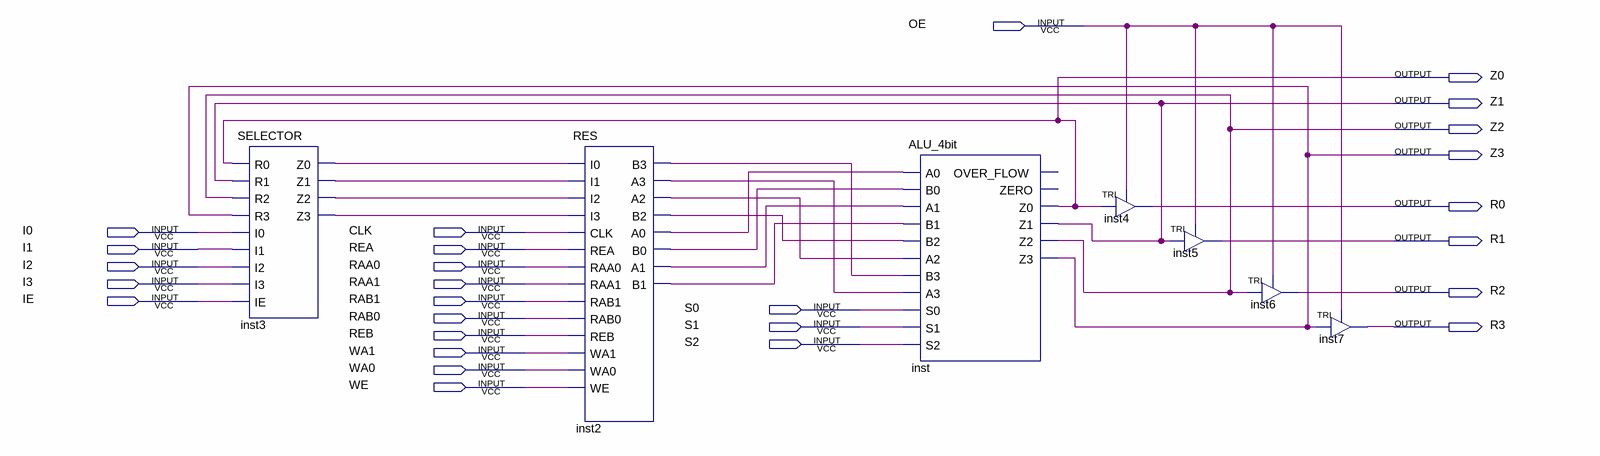
[diagram p0: schematic sheet]
// Quartus schematic DATAPATH.bdf as structural Verilog: 7 symbols, 27 pins
module DATAPATH (
  input  OE,
  input  I0,
  input  CLK,
  input  I1,
  input  REA,
  input  I2,
  input  RAA0,
  input  I3,
  input  RAA1,
  input  IE,
  input  RAB1,
  input  S0,
  input  RAB0,
  input  S1,
  input  REB,
  input  S2,
  input  WA1,
  input  WA0,
  input  WE,
  output Z0,
  output Z1,
  output Z2,
  output Z3,
  output R0,
  output R1,
  output R2,
  output R3
);

  wire inst2_a0, inst2_a1, inst2_a2, inst2_a3, inst2_b0, inst2_b1, inst2_b2, inst2_b3, inst3_z0, inst3_z1,
       inst3_z2, inst3_z3;

  SELECTOR inst3 (
    .R0(Z0), .R1(Z1), .R2(Z2), .R3(Z3), .I0(I0), .I1(I1), .I2(I2), .I3(I3), .IE(IE), .Z0(inst3_z0),
    .Z1(inst3_z1), .Z2(inst3_z2), .Z3(inst3_z3));
  RES inst2 (
    .I0(inst3_z0), .I1(inst3_z1), .I2(inst3_z2), .I3(inst3_z3), .CLK(CLK), .REA(REA), .RAA0(RAA0),
    .RAA1(RAA1), .RAB1(RAB1), .RAB0(RAB0), .REB(REB), .WA1(WA1), .WA0(WA0), .WE(WE), .B3(inst2_b3),
    .A3(inst2_a3), .A2(inst2_a2), .B2(inst2_b2), .A0(inst2_a0), .B0(inst2_b0), .A1(inst2_a1), .B1(inst2_b1));
  ALU_4bit inst (
    .A0(inst2_a0), .B0(inst2_b0), .A1(inst2_a1), .B1(inst2_b1), .B2(inst2_b2), .A2(inst2_a2), .B3(inst2_b3),
    .A3(inst2_a3), .S0(S0), .S1(S1), .S2(S2), .Z0(Z0), .Z1(Z1), .Z2(Z2), .Z3(Z3));  // open: OVER_FLOW, ZERO
  TRI inst4 (.IN(Z0), .OE(OE), .OUT(R0));
  TRI inst5 (.IN(Z1), .OE(OE), .OUT(R1));
  TRI inst6 (.IN(Z2), .OE(OE), .OUT(R2));
  TRI inst7 (.IN(Z3), .OE(OE), .OUT(R3));
endmodule
